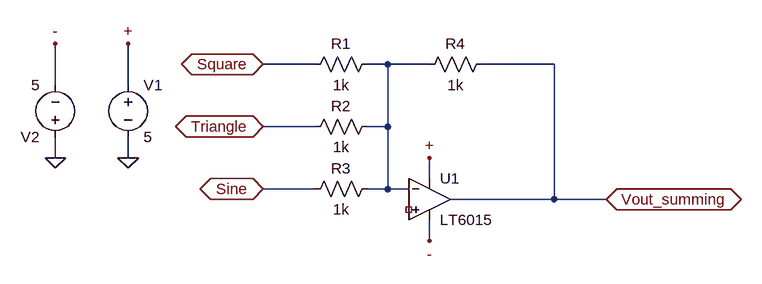
[diagram p0: schematic Summing_amplifier_small.asc]
Summing_amplifier_small.asc, the LTspice schematic file:
Version 4
SHEET 1 880 680
WIRE 48 16 -32 16
WIRE 160 16 128 16
WIRE 224 16 160 16
WIRE 416 16 304 16
WIRE -352 48 -352 -16
WIRE -240 48 -240 -16
WIRE 48 112 -32 112
WIRE 160 112 160 16
WIRE 160 112 128 112
WIRE -352 160 -352 128
WIRE -240 160 -240 128
WIRE 224 192 224 160
WIRE 48 208 -32 208
WIRE 160 208 160 112
WIRE 160 208 128 208
WIRE 192 208 160 208
WIRE 416 224 416 16
WIRE 416 224 256 224
WIRE 496 224 416 224
WIRE 224 288 224 256
FLAG -32 208 Sine
IOPIN -32 208 BiDir
FLAG -32 16 Square
IOPIN -32 16 BiDir
FLAG -32 112 Triangle
IOPIN -32 112 BiDir
FLAG 496 224 Vout_summing
IOPIN 496 224 BiDir
FLAG -240 160 0
FLAG -352 160 0
FLAG 224 160 +
FLAG -240 -16 +
FLAG 224 288 -
FLAG -352 -16 -
SYMBOL res 144 0 R90
WINDOW 0 0 56 VBottom 2
WINDOW 3 32 56 VTop 2
SYMATTR InstName R1
SYMATTR Value 1k
SYMBOL res 144 96 R90
WINDOW 0 0 56 VBottom 2
WINDOW 3 32 56 VTop 2
SYMATTR InstName R2
SYMATTR Value 1k
SYMBOL res 144 192 R90
WINDOW 0 0 56 VBottom 2
WINDOW 3 32 56 VTop 2
SYMATTR InstName R3
SYMATTR Value 1k
SYMBOL res 320 0 R90
WINDOW 0 0 56 VBottom 2
WINDOW 3 32 56 VTop 2
SYMATTR InstName R4
SYMATTR Value 1k
SYMBOL Opamps\\LT6015 224 224 R0
SYMATTR InstName U1
SYMBOL voltage -240 32 R0
WINDOW 123 0 0 Left 0
WINDOW 39 0 0 Left 0
SYMATTR InstName V1
SYMATTR Value 5
SYMBOL voltage -352 144 R180
WINDOW 123 0 0 Left 0
WINDOW 39 0 0 Left 0
SYMATTR InstName V2
SYMATTR Value 5

The netlist it stands for:
* Summing_amplifier_small.asc
R1 N001 Square 1k
R2 N001 Triangle 1k
R3 N001 Sine 1k
R4 Vout_summing N001 1k
XU1 NC_01 N001 + - Vout_summing LT6016  ; LT6015, pins In+ In- V+ V- OUT
V1 + 0 5
V2 0 - 5
.lib LTC2.lib
.backanno
.end